# EAGLE design MasC=uerade (EAGLE 5.06)
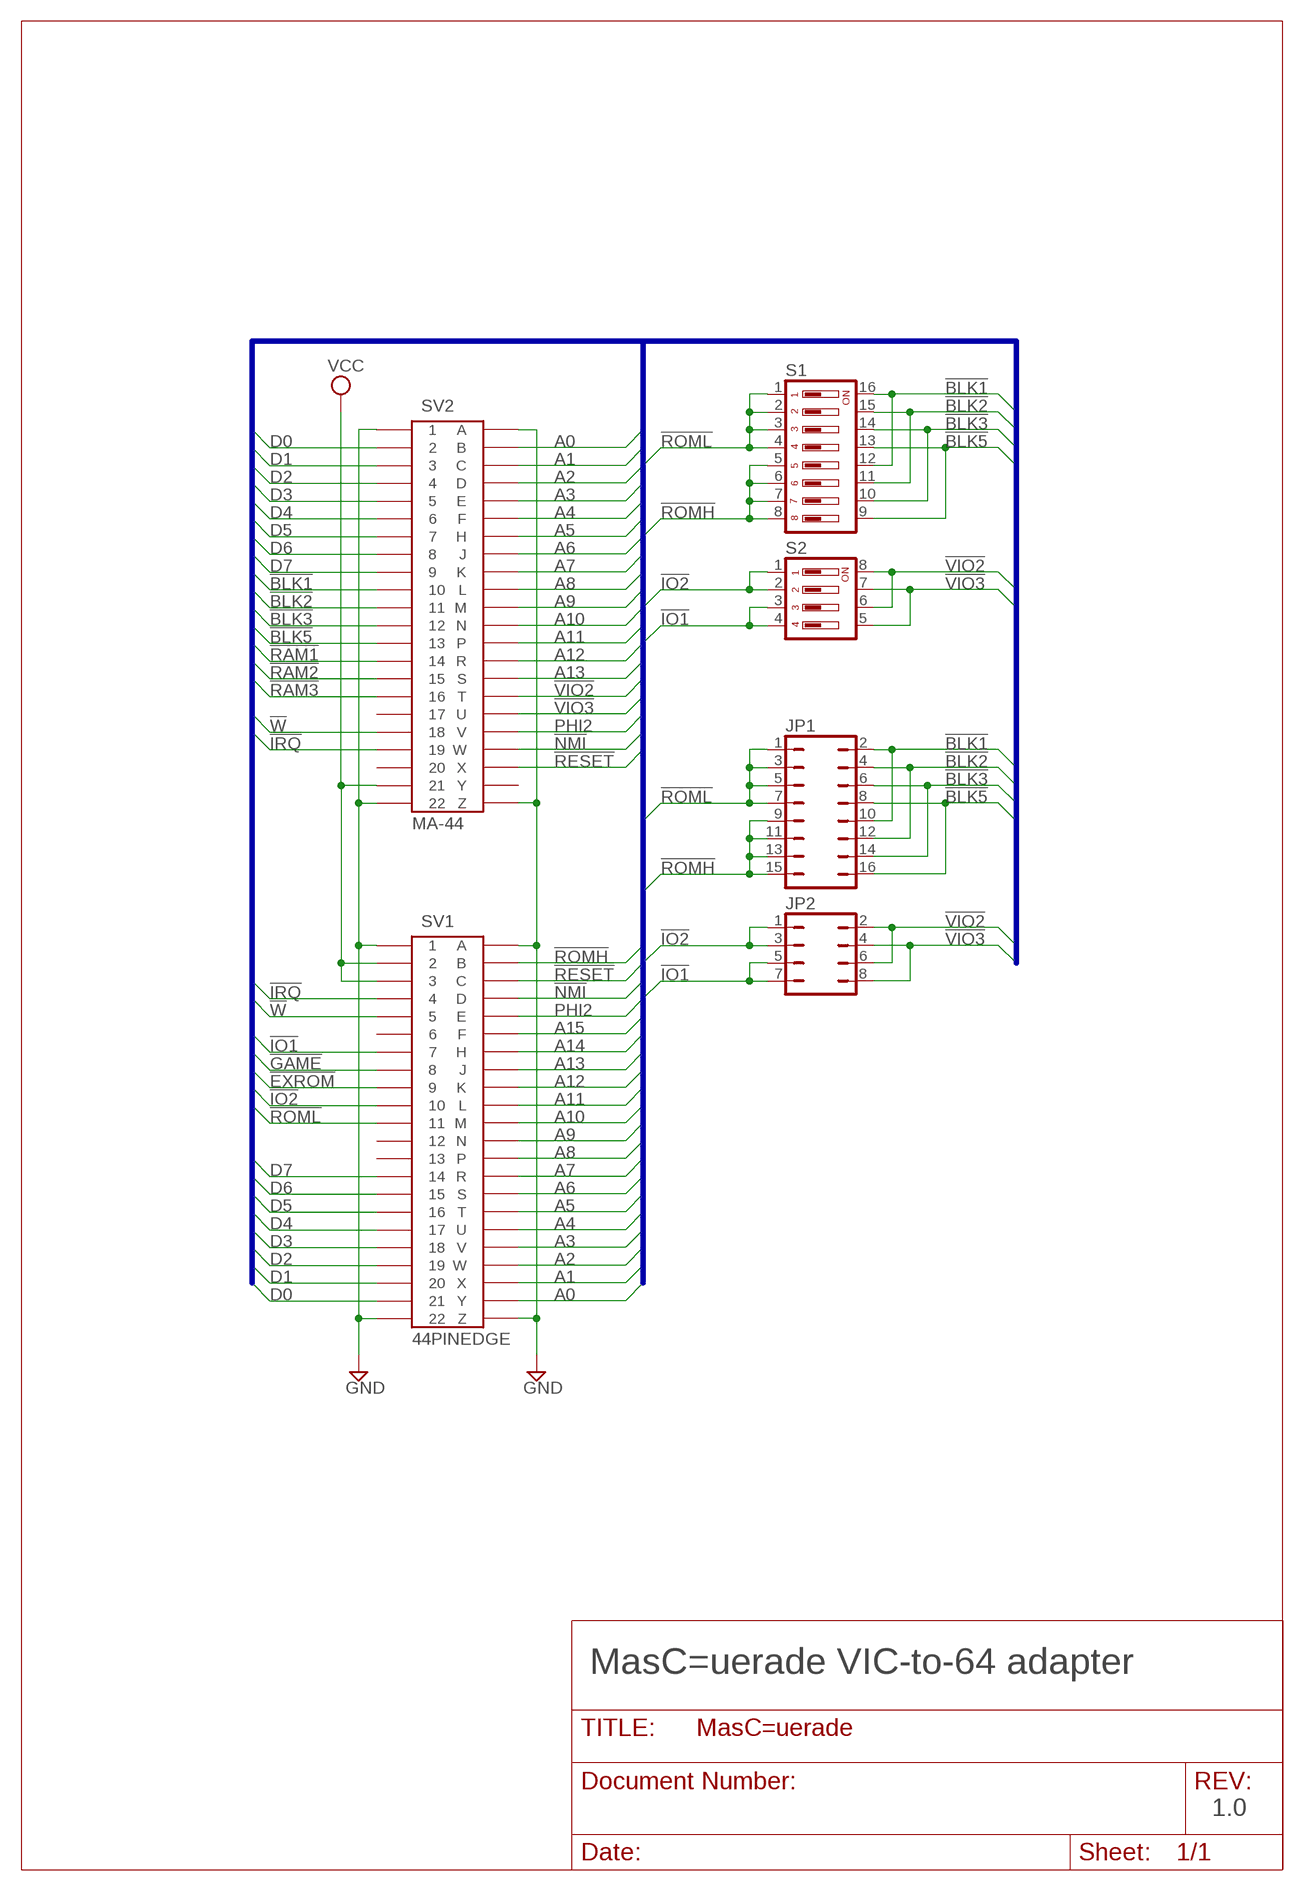
[diagram p0: schematic, sheet 1]

## Parts
JP1  JP8Q  [JP8Q]
JP2  JP4Q  [JP4Q]
S1  DP08  [DP-08]
S2  DP04  [DP-04]
SV1  44PINEDGE  [44PINEDGE]
SV2  MA-44  [MA-44]

## Nets
!BLK1: JP1.2 JP1.10 S1.12 S1.16 SV2.10
!BLK2: JP1.4 JP1.12 S1.11 S1.15 SV2.11
!BLK3: JP1.6 JP1.14 S1.10 S1.14 SV2.12
!BLK5: JP1.8 JP1.16 S1.9 S1.13 SV2.13
!EXROM: SV1.9
!GAME: SV1.8
!IO1: JP2.5 JP2.7 S2.3 S2.4 SV1.7
!IO2: JP2.1 JP2.3 S2.1 S2.2 SV1.10
!IRQ: SV1.4 SV2.19
!NMI: SV1.D SV2.W
!RAM1: SV2.14
!RAM2: SV2.15
!RAM3: SV2.16
!RESET: SV1.C SV2.X
!ROMH: JP1.9 JP1.11 JP1.13 JP1.15 S1.5 S1.6 S1.7 S1.8 SV1.B
!ROML: JP1.1 JP1.3 JP1.5 JP1.7 S1.1 S1.2 S1.3 S1.4 SV1.11
!VIO2: JP2.2 JP2.6 S2.6 S2.8 SV2.T
!VIO3: JP2.4 JP2.8 S2.5 S2.7 SV2.U
!W: SV1.5 SV2.18
A0: SV1.Y SV2.B
A1: SV1.X SV2.C
A2: SV1.W SV2.D
A3: SV1.V SV2.E
A4: SV1.U SV2.F
A5: SV1.T SV2.H
A6: SV1.S SV2.J
A7: SV1.R SV2.K
A8: SV1.P SV2.L
A9: SV1.N SV2.M
A10: SV1.M SV2.N
A11: SV1.L SV2.P
A12: SV1.K SV2.R
A13: SV1.J SV2.S
A14: SV1.H
A15: SV1.F
D0: SV1.21 SV2.2
D1: SV1.20 SV2.3
D2: SV1.19 SV2.4
D3: SV1.18 SV2.5
D4: SV1.17 SV2.6
D5: SV1.16 SV2.7
D6: SV1.15 SV2.8
D7: SV1.14 SV2.9
GND: SV1.1 SV1.22 SV1.A SV1.Z SV2.1 SV2.22 SV2.A SV2.Z
PHI2: SV1.E SV2.V
VCC: SV1.2 SV1.3 SV2.21
Unconnected: SV1.6 SV1.12 SV1.13 SV2.17 SV2.20 SV2.Y

## Buses
A[0..15],!W,PHI2,!IO1,!IO2,D[0..7],!RESET,!EXROM,!GAME,!IRQ,!NMI,!VIO2,!VIO3,!RAM1,!RAM2,!RAM3,!BLK1,!BLK2,!BLK3,!BLK5,!ROMH,!ROML

## Notes on the sheet
- MasC=uerade VIC-to-64 adapter
- 1.0

## Library data of the parts
JP1 = jumper:JP8Q: JUMPER
JP2 = jumper:JP4Q: JUMPER
S1 = switch-dil:DP08: DIL/CODE SWITCH
S2 = switch-dil:DP04: DIL/CODE SWITCH
SV1 = con-edge-100:44PINEDGE: 44 PIN EDGE CONNECTOR FOR PCB
SV2 = con-edge-156:MA-44: 44 PIN EDGE CONNECTOR FOR PCB

## Board
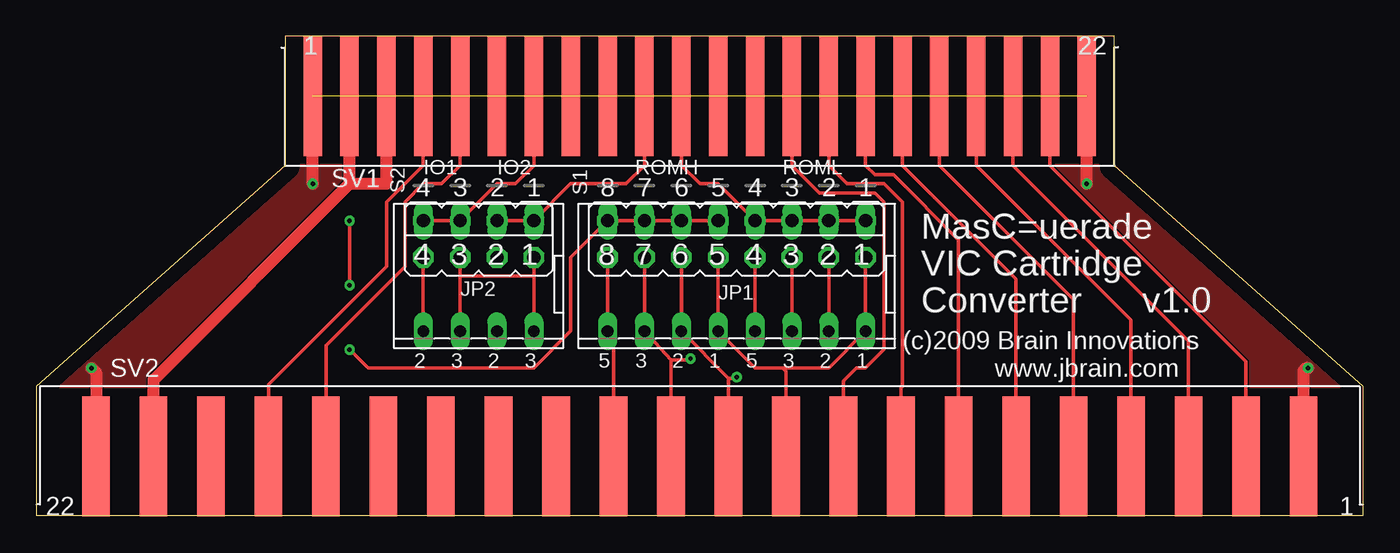
[diagram p1: board, top side]
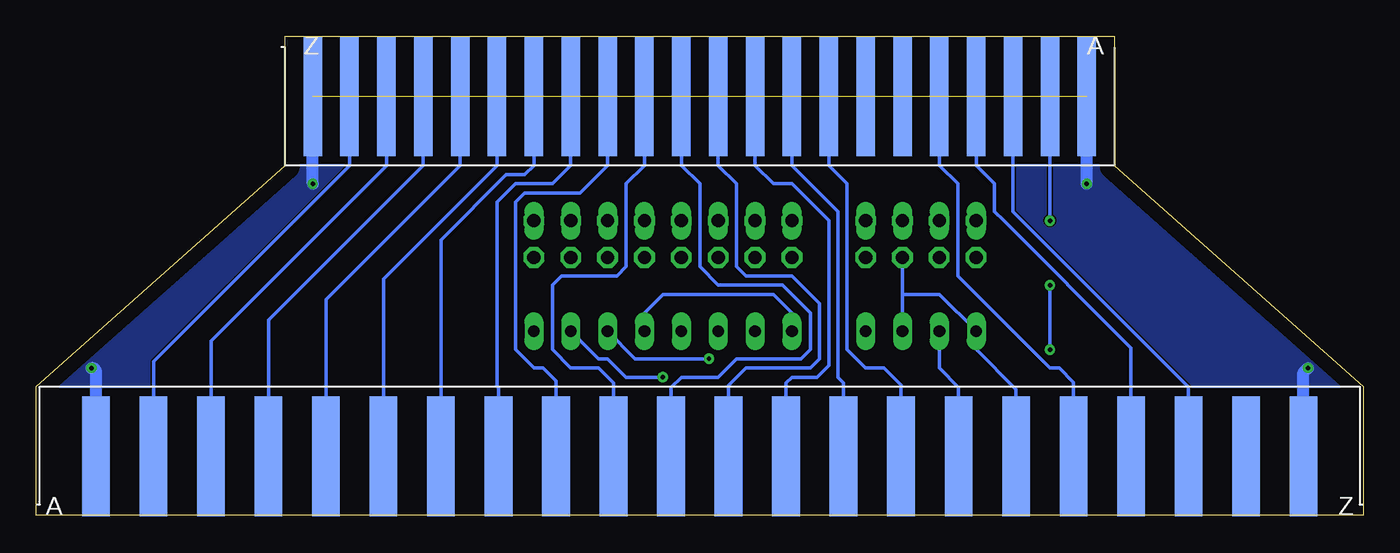
[diagram p2: board, bottom side, seen from below]

Size 91.44 x 33.02 mm. Coordinates in mm from the lower left corner, seen from the top.
Outline: 0,0 91.44,0 91.44,8.89 74.3,24.13 74.3,33.02 17.14,33.02 17.14,24.13 0,8.89 0,0
Copper layers (1*16): Top 0.035mm / dielectric 1.5mm / Bottom 0.035mm
Design rules "ourpcb-small": minimum track width 4mil, minimum drill 12mil, track to track 4mil, track to pad 4mil, pad to pad 4mil, via to via 4mil, smd to smd 0mil, copper to edge 40mil, drill to drill 8mil, minimum pad ring 10mil, minimum via ring 8mil, stop-mask expansion 4mil, vias tented up to drill 0mil, thermal gap 10mil

### Footprints (pad centres in the part's own frame; a part is rotated, then mirrored left to right if it is on the bottom)
JP8Q = drill 0.914 octagon: 1 -8.89,-1.27; 2 -8.89,1.27; 3 -6.35,-1.27; 4 -6.35,1.27; 5 -3.81,-1.27; 6 -3.81,1.27; 7 -1.27,-1.27; 8 -1.27,1.27; 9 1.27,-1.27; 10 1.27,1.27; 11 3.81,-1.27; 12 3.81,1.27; 13 6.35,-1.27; 14 6.35,1.27; 15 8.89,-1.27; 16 8.89,1.27
JP4Q = drill 0.914 octagon: 1 -3.81,-1.27; 2 -3.81,1.27; 3 -1.27,-1.27; 4 -1.27,1.27; 5 1.27,-1.27; 6 1.27,1.27; 7 3.81,-1.27; 8 3.81,1.27
DP-08 = drill 0.813 long: 1 -8.89,-3.81; 2 -6.35,-3.81; 3 -3.81,-3.81; 4 -1.27,-3.81; 5 1.27,-3.81; 6 3.81,-3.81; 7 6.35,-3.81; 8 8.89,-3.81; 9 8.89,3.81; 10 6.35,3.81; 11 3.81,3.81; 12 1.27,3.81; 13 -1.27,3.81; 14 -3.81,3.81; 15 -6.35,3.81; 16 -8.89,3.81
DP-04 = drill 0.813 long: 1 -3.81,-3.81; 2 -1.27,-3.81; 3 1.27,-3.81; 4 3.81,-3.81; 5 3.81,3.81; 6 1.27,3.81; 7 -1.27,3.81; 8 -3.81,3.81
44PINEDGE = smd 1.27 x 8.255: 1 -24.765,-0.305; 2 -22.225,-0.305; 3 -19.685,-0.305; 4 -17.145,-0.305; 5 -14.605,-0.305; 6 -12.065,-0.305; 7 -9.525,-0.305; 8 -6.985,-0.305; 9 -4.445,-0.305; 10 -1.905,-0.305; 11 0.635,-0.305; 12 3.175,-0.305; 13 5.715,-0.305; 14 8.255,-0.305; 15 10.795,-0.305; 16 13.335,-0.305; 17 15.875,-0.305; 18 18.415,-0.305; 19 20.955,-0.305; 20 23.495,-0.305; 21 26.035,-0.305; 22 28.575,-0.305 | smd 1.27 x 8.255 bottom: A -24.765,-0.305; B -22.225,-0.305; C -19.685,-0.305; D -17.145,-0.305; E -14.605,-0.305; F -12.065,-0.305; H -9.525,-0.305; J -6.985,-0.305; K -4.445,-0.305; L -1.905,-0.305; M 0.635,-0.305; N 3.175,-0.305; P 5.715,-0.305; R 8.255,-0.305; S 10.795,-0.305; T 13.335,-0.305; U 15.875,-0.305; V 18.415,-0.305; W 20.955,-0.305; X 23.495,-0.305; Y 26.035,-0.305; Z 28.575,-0.305
MA-44 = smd 1.905 x 8.255: 1 -41.605,4.826; 2 -37.643,4.826; 3 -33.68,4.826; 4 -29.718,4.826; 5 -25.756,4.826; 6 -21.793,4.826; 7 -17.831,4.826; 8 -13.868,4.826; 9 -9.906,4.826; 10 -5.944,4.826; 11 -1.981,4.826; 12 1.981,4.826; 13 5.944,4.826; 14 9.906,4.826; 15 13.868,4.826; 16 17.831,4.826; 17 21.793,4.826; 18 25.756,4.826; 19 29.718,4.826; 20 33.68,4.826; 21 37.643,4.826; 22 41.605,4.826 | smd 1.905 x 8.255 bottom: A -41.605,4.826; B -37.643,4.826; C -33.68,4.826; D -29.718,4.826; E -25.756,4.826; F -21.793,4.826; H -17.831,4.826; J -13.868,4.826; K -9.906,4.826; L -5.944,4.826; M -1.981,4.826; N 1.981,4.826; P 5.944,4.826; R 9.906,4.826; S 13.868,4.826; T 17.831,4.826; U 21.793,4.826; V 25.756,4.826; W 29.718,4.826; X 33.68,4.826; Y 37.643,4.826; Z 41.605,4.826

### Placement (x,y rotation side)
JP1  48.26,19.05 180 top
JP2  30.48,19.05 180 top
S1  48.26,16.51 180 top
S2  30.48,16.51 180 top
SV1  43.81,29.21 0 top
SV2  45.72,8.89 180 top

### Tracks (layer width: path | path; a pad name or v marks a point on that pad's centre or on a via)
!BLK1
  Top 0.254: JP1.10 S1.12 49.53,10.16 51.44,10.16 | JP1.2 S1.16 54.61,10.16 51.44,10.16 | SV2.10 51.66,9.93 51.44,10.16
!BLK2  (via drill 0.3)
  Top 0.254: JP1.12 S1.11 47.7,9.45 | S1.15 JP1.4 | SV2.11 47.7,9.45 | 47.7,9.45 48.18,9.45 v48.26,9.53
  Bottom 0.254: v48.26,9.53 50.8,9.53 52.07,10.79 52.7,10.79 S1.15
!BLK3  (via drill 0.3)
  Top 0.254: JP1.14 S1.10 43.74,10.72 | S1.14 JP1.6 | SV2.12 43.74,10.72 | 43.74,10.72 45.01,10.72 v45.09,10.79
  Bottom 0.254: v45.09,10.79 50.16,10.79 S1.14
!BLK5
  Top 0.254: JP1.16 S1.9 39.78,12.29 SV2.13 | S1.13 JP1.8
  Bottom 0.254: S1.13 49.53,13.97 48.26,15.24 40.64,15.24 39.37,13.97 S1.9
!IO1
  Top 0.254: SV1.7 34.29,24.13 33.02,22.86 31.75,22.86 JP2.5 JP2.7
!IO2
  Top 0.254: SV1.10 41.91,24.13 40.64,22.86 36.83,22.86 JP2.1 JP2.3
!IRQ
  Top 0.254: SV2.19 16,9.02 24.13,17.14 24.13,21.59 26.67,24.13 SV1.4
!NMI
  Bottom 0.254: SV2.W 16,11.56 24.77,20.32 25.4,20.95 25.4,22.86 26.67,24.13 SV1.D
!RESET
  Bottom 0.254: SV2.X 12.04,8.87 24.13,20.95 SV1.C
!ROMH  (via drill 0.3)
  Top 0.254: v21.59,11.43 22.86,10.16 34.29,10.16 36.83,12.7 36.83,17.78 JP1.15 JP1.13 JP1.11 JP1.9 | v21.59,15.88 v21.59,20.32
  Bottom 0.254: v21.59,20.32 SV1.B | v21.59,11.43 v21.59,15.88
!ROML
  Top 0.254: SV1.11 44.45,24.13 45.72,22.86 46.99,22.86 JP1.7 JP1.5 JP1.3 JP1.1
!VIO2
  Top 0.254: 34.29,16.51 S2.8 | S2.6 29.21,16.51 | 29.21,16.51 JP2.6 | 34.29,16.51 JP2.2 | 29.21,16.51 34.29,16.51
  Bottom 0.254: SV2.T 27.89,8.84 29.21,10.16 S2.6
!VIO3
  Top 0.254: S2.5 JP2.8
  Bottom 0.254: 31.75,15.24 S2.7 | 31.75,15.24 JP2.4 | SV2.U 23.93,8.69 26.67,11.43 S2.5 29.21,15.24 31.75,15.24
!W
  Top 0.254: SV1.5 29.21,24.13 27.94,22.86 26.67,22.86 25.4,21.59 25.4,17.14 19.96,11.71 SV2.18
A0
  Bottom 0.254: SV1.Y 69.85,24.13 83.36,10.62 SV2.B
A1
  Bottom 0.254: SV1.X 67.31,24.13 79.4,12.04 SV2.C
A2
  Bottom 0.254: SV1.W 64.77,24.13 75.44,13.46 SV2.D
A3
  Bottom 0.254: SV1.V 62.23,24.13 71.48,14.88 SV2.E
A4
  Bottom 0.254: SV1.U 59.69,24.13 67.51,16.31 SV2.F
A5
  Bottom 0.254: SV1.T 57.15,24.13 57.78,23.5 59.05,23.5 63.55,19 SV2.H
A6
  Bottom 0.254: SV1.S 54.61,24.13 55.88,22.86 58.42,22.86 59.69,21.59 59.69,8.89 59.59,8.79 SV2.J
A7
  Bottom 0.254: SV1.R 52.07,24.13 53.98,22.23 57.78,22.23 58.42,21.59 58.42,11.43 57.15,10.16 56.52,10.16 55.63,9.27 SV2.K
A8
  Bottom 0.254: SV1.P 49.53,24.13 50.8,22.86 50.8,17.14 51.44,16.51 55.24,16.51 55.88,15.88 55.88,11.43 54.61,10.16 52.7,10.16 51.66,9.12 SV2.L
A9
  Bottom 0.254: SV1.N 46.99,24.13 45.72,22.86 45.72,17.14 44.45,15.88 40.01,15.88 38.1,13.97 38.1,11.43 38.73,10.79 43.18,10.79 44.45,9.53 46.99,9.53 47.7,8.81 SV2.M
A10
  Bottom 0.254: SV1.M 44.45,24.13 43.18,22.86 43.18,17.14 42.55,16.51 39.37,16.51 37.47,14.61 37.47,10.79 38.1,10.16 42.55,10.16 43.74,8.97 SV2.N
A11
  Bottom 0.254: SV1.L 41.91,24.13 40.64,22.86 39.37,22.86 36.83,20.32 36.83,10.34 37.64,9.53 39.37,9.53 39.78,9.12 SV2.P
A12
  Bottom 0.254: SV2.R 35.81,9.14 36.2,9.53 36.2,20.95 39.37,24.13 SV1.K
A13
  Bottom 0.254: SV2.S 31.85,8.99 33.02,10.16 34.29,10.16 35.56,11.43 35.56,22.86 36.83,24.13 SV1.J
D0
  Top 0.254: SV1.21 69.85,24.13 83.36,10.62 SV2.2
D1
  Top 0.254: SV1.20 67.31,24.13 79.4,12.04 SV2.3
D2
  Top 0.254: SV1.19 64.77,24.13 75.44,13.46 SV2.4
D3
  Top 0.254: SV1.18 62.23,24.13 71.48,14.88 SV2.5
D4
  Top 0.254: SV1.17 59.69,24.13 67.51,16.31 SV2.6
D5
  Top 0.254: SV2.7 63.55,19 59.05,23.5 57.78,23.5 57.15,24.13 SV1.16
D6
  Top 0.254: SV1.15 54.61,24.13 55.88,22.86 58.42,22.86 59.69,21.59 59.69,8.89 59.59,8.79 SV2.8
D7
  Top 0.254: SV1.14 52.07,24.13 53.98,22.23 57.78,22.23 58.42,21.59 58.42,11.43 57.15,10.16 56.52,10.16 55.63,9.27 SV2.9
GND  (via drill 0.3)  (1 unrouted)
  Top 0.813: v19.05,22.86 SV1.A | SV2.Z 4.12,9.86 v3.81,10.16 | SV2.A 87.33,9.86 arc-90 v87.63,10.16 | v72.39,22.86 SV1.Z
  Bottom 0.813: v19.05,22.86 SV1.A | v3.81,10.16 4.12,9.86 SV2.Z | SV2.A 87.33,9.86 arc-90 v87.63,10.16 | v72.39,22.86 SV1.Z
  pour Bottom: 17.14,24.13 0,8.89 91.44,8.89 74.3,24.13
  pour Top: 17.14,24.13 0,8.89 91.44,8.89 74.3,24.13
PHI2
  Bottom 0.254: SV1.E 29.21,24.13 27.94,22.86 27.94,16.51 21.59,10.16 20.95,10.16 19.96,9.17 SV2.V
VCC
  Top 0.813: SV2.21 8.08,9.35 21.59,22.86 | 21.59,22.86 SV1.2 | 21.59,22.86 24.13,22.86 SV1.3

### Text on the board
tNames: IO1 | IO2 | ROMH | ROML | MasC=uerade | VIC Cartridge | Converter | v1.0 | (c)2009 Brain Innovations | 2 | 3 | 2 | 3 | 5 | 3 | 2 | 1 | 5 | 3 | 2 | 1 | www.jbrain.com